# EAGLE design timer (EAGLE 9.6.2)
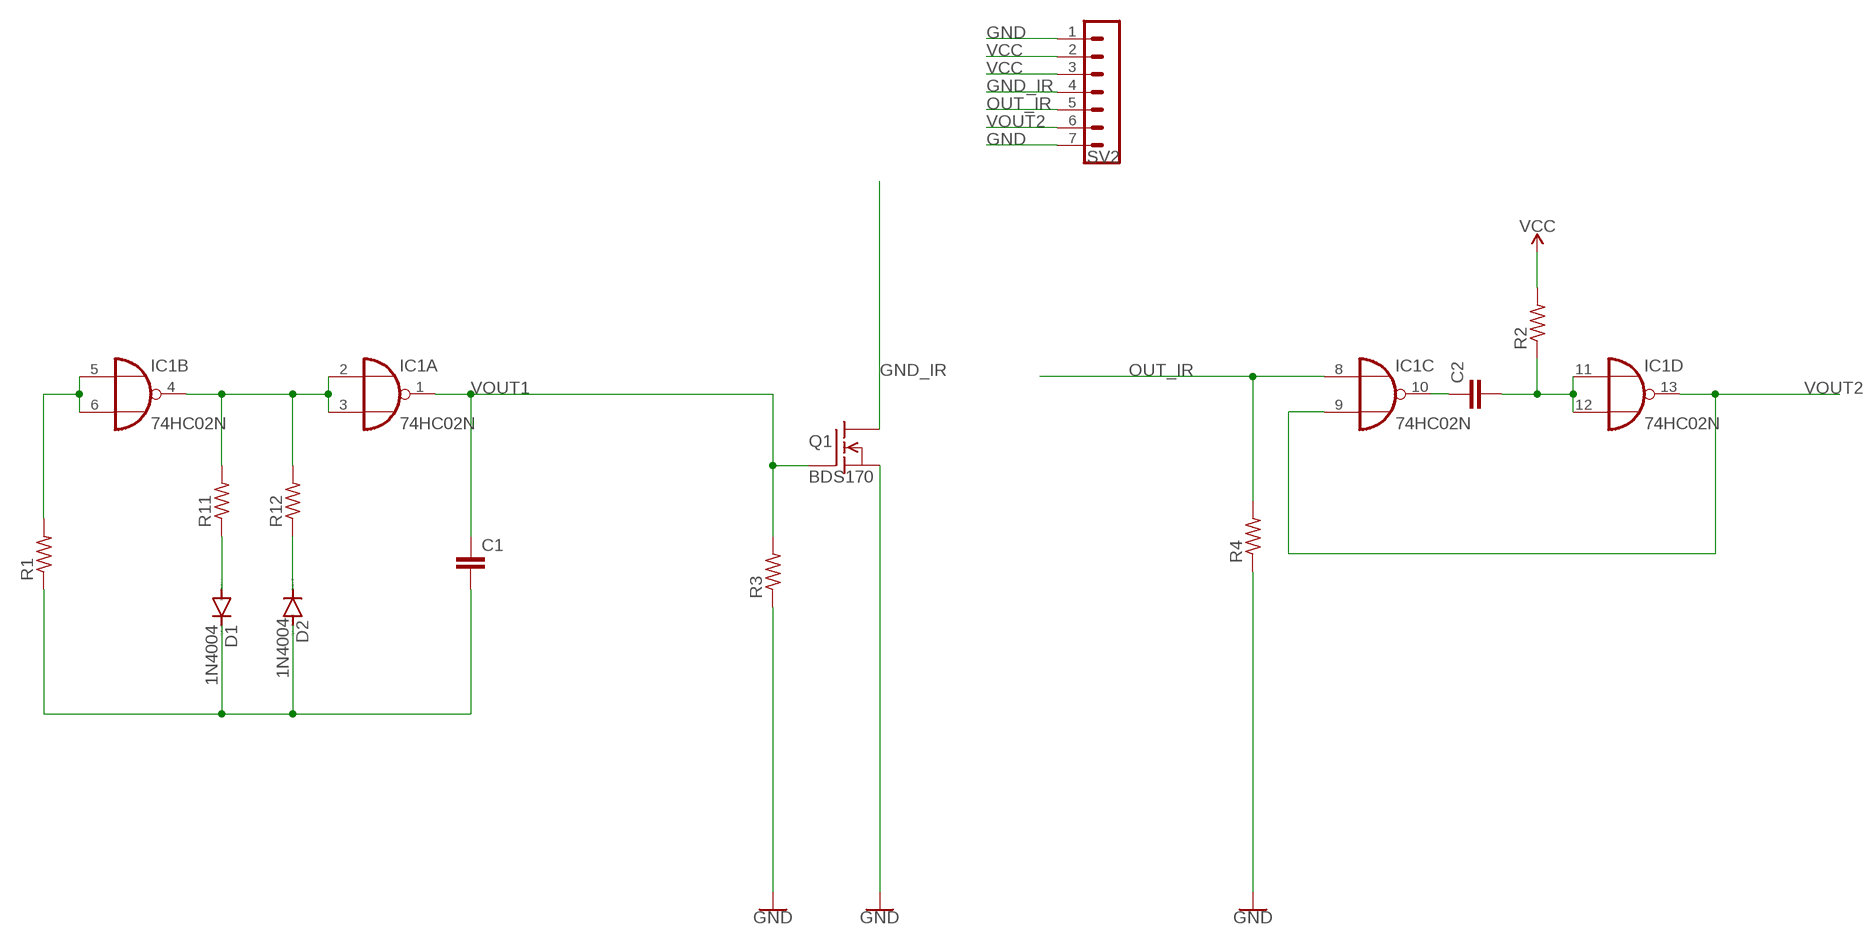
[diagram p0: schematic, sheet 1]

## Parts
C1  C-EU025-024X044  [C025-024X044]
C2  C-EU050-025X075  [C050-025X075]
D1  1N4004  [DO41-10]
D2  1N4004  [DO41-10]
IC1  74HC02N  [DIL14]
Q1  VN10KM  [TO92-]
R1  R-US_0207/10  [0207/10]
R2  R-US_0207/10  [0207/10]
R3  R-US_0207/10  [0207/10]
R4  R-US_0207/10  [0207/10]
R11  R-US_0207/10  [0207/10]
R12  R-US_0207/10  [0207/10]
SV2  MA07-1  [MA07-1]

## Nets
GND: Q1.3(S) R3.1 R4.1 SV2.1 SV2.7
GND_IR: Q1.1(D) SV2.4
N$1: IC1.2(A:I0) IC1.3(A:I1) IC1.4(B:O) R11.2 R12.2
N$2: IC1.5(B:I0) IC1.6(B:I1) R1.2
N$3: D1.A R11.1
N$4: D2.C R12.1
N$5: C1.2 D1.C D2.A R1.1
N$7: C2.2 IC1.11(D:I0) IC1.12(D:I1) R2.1
N$8: C2.1 IC1.10(C:O)
OUT_IR: IC1.8(C:I0) R4.2 SV2.5
VCC: R2.2 SV2.2 SV2.3
VOUT1: C1.1 IC1.1(A:O) Q1.2(G) R3.2
VOUT2: IC1.9(C:I1) IC1.13(D:O) SV2.6

## Notes on the sheet
- BDS170

## Power pins joined to a net without a drawn wire
GND: IC1.7(P:GND)
VCC: IC1.14(P:VCC)

## Library data of the parts
C1 C2 = rcl:C-EU: CAPACITOR, European symbol; SPICEPREFIX: C
D1 D2 = diode:1N4004: DIODE general purpose rectifier, 1 A
IC1 = 74xx-eu:74*02: Quad 2-input NOR gate
Q1 = transistor-fet(IRF510 LONGER LEGS):VN10KM: N-Channel Enhancement MOSFET (VMOS); 60V; 0,5A; 5,0Ohm
R1-R4 R11 R12 = rcl:R-US_: RESISTOR, American symbol; SPICEPREFIX: R
SV2 = con-lstb:MA07-1: PIN HEADER; OC_FARNELL: unknown; OC_NEWARK: unknown

## Board
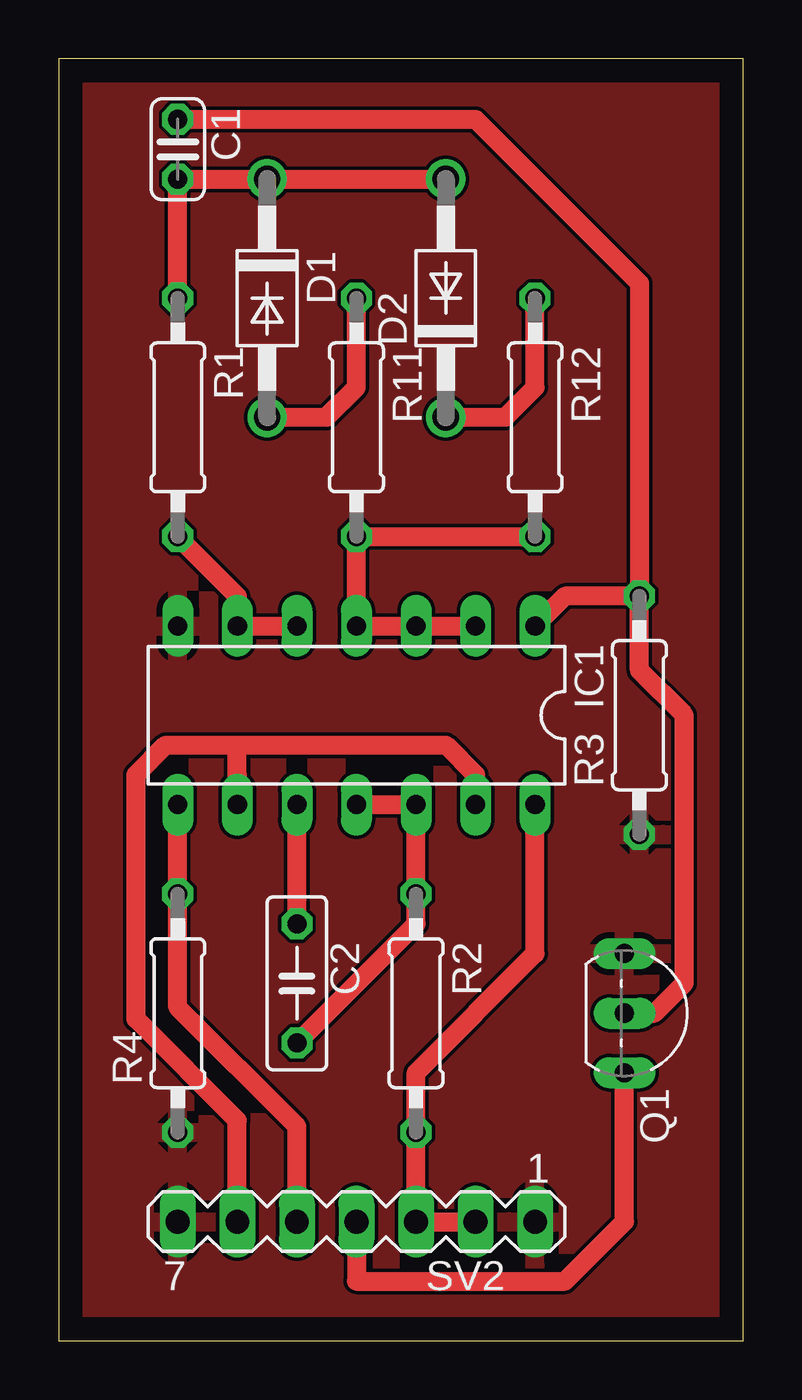
[diagram p1: board, top side]

Size 29.19 x 54.66 mm. Coordinates in mm from the lower left corner, seen from the top.
Outline: 0,0 29.19,0 29.19,54.66 0,54.66 0,0
Copper layers (1*16): Top 0.035mm / dielectric 1.5mm / Bottom 0.035mm
Design rules "default": minimum track width 6mil, minimum drill 0.35mm, track to track 6mil, track to pad 6mil, pad to pad 6mil, via to via 6mil, smd to smd 6mil, copper to edge 40mil, drill to drill 6mil, minimum pad ring 10mil, minimum via ring 8mil, stop-mask expansion 4mil, vias tented up to drill 0mil, thermal gap 10mil

### Footprints (pad centres in the part's own frame; a part is rotated, then mirrored left to right if it is on the bottom)
C025-024X044 = drill 0.813 octagon: 1 -1.27,0; 2 1.27,0
C050-025X075 = drill 0.813 octagon: 1 -2.54,0; 2 2.54,0
DO41-10 = drill 1.118: A 5.08,0; C -5.08,0
DIL14 = drill 0.813 long: 1 -7.62,-3.81; 2 -5.08,-3.81; 3 -2.54,-3.81; 4 0,-3.81; 5 2.54,-3.81; 6 5.08,-3.81; 7 7.62,-3.81; 8 7.62,3.81; 9 5.08,3.81; 10 2.54,3.81; 11 0,3.81; 12 -2.54,3.81; 13 -5.08,3.81; 14 -7.62,3.81
TO92- = drill 0.813 long: 1 2.54,0; 2 0,0; 3 -2.54,0
0207/10 = drill 0.813 octagon: 1 -5.08,0; 2 5.08,0
MA07-1 = drill 1.016 long: 1 -7.62,0; 2 -5.08,0; 3 -2.54,0; 4 0,0; 5 2.54,0; 6 5.08,0; 7 7.62,0

### Placement (x,y rotation side)
C1  5.08,50.8 270 top
C2  10.16,15.24 270 top
D1  8.89,44.45 270 top
D2  16.51,44.45 90 top
IC1  12.7,26.67 180 top
Q1  24.13,13.97 270 top
R1  5.08,39.37 270 top
R2  15.24,13.97 270 top
R3  24.77,26.67 90 top
R4  5.08,13.97 90 top
R11  12.7,39.37 270 top
R12  20.32,39.37 270 top
SV2  12.7,5.08 180 top

### Tracks (layer width: path | path; a pad name or v marks a point on that pad's centre or on a via)
GND
  pour Top: 0,54.61 29.21,54.61 29.21,0 0,0
GND_IR
  Top 0.813: Q1.1 24.13,5.08 21.59,2.54 12.7,2.54 SV2.4
N$1
  Top 0.813: IC1.2 IC1.3 IC1.4 R11.2 R12.2
N$2
  Top 0.813: IC1.5 IC1.6 7.62,31.75 R1.2
N$3
  Top 0.813: D1.A 11.43,39.37 12.7,40.64 R11.1
N$4
  Top 0.813: D2.C 19.05,39.37 20.32,40.64 R12.1
N$5
  Top 0.813: R1.1 C1.2 D1.C D2.A
N$7
  Top 0.813: IC1.11 IC1.12 R2.1 15.24,17.78 C2.2
N$8
  Top 0.813: C2.1 IC1.10
OUT_IR
  Top 0.813: IC1.8 R4.2 5.08,14.22 10.16,9.14 SV2.5
VCC
  Top 0.813: IC1.14 20.32,16.51 15.24,11.43 R2.2 SV2.3 SV2.2
VOUT1
  Top 0.813: C1.1 17.78,52.07 24.77,45.09 R3.2 | IC1.1 21.59,31.75 R3.2 | Q1.2 25.4,13.97 26.67,15.24 26.67,26.67 24.77,28.58 R3.2
VOUT2
  Top 0.813: 7.62,24.13 IC1.9 7.62,25.4 | 7.62,25.4 16.51,25.4 17.78,24.13 IC1.13 | SV2.6 7.62,9.4 3.3,13.72 3.3,24.13 4.57,25.4 7.62,25.4